# EAGLE schematic mother_bord (EAGLE 6.2)
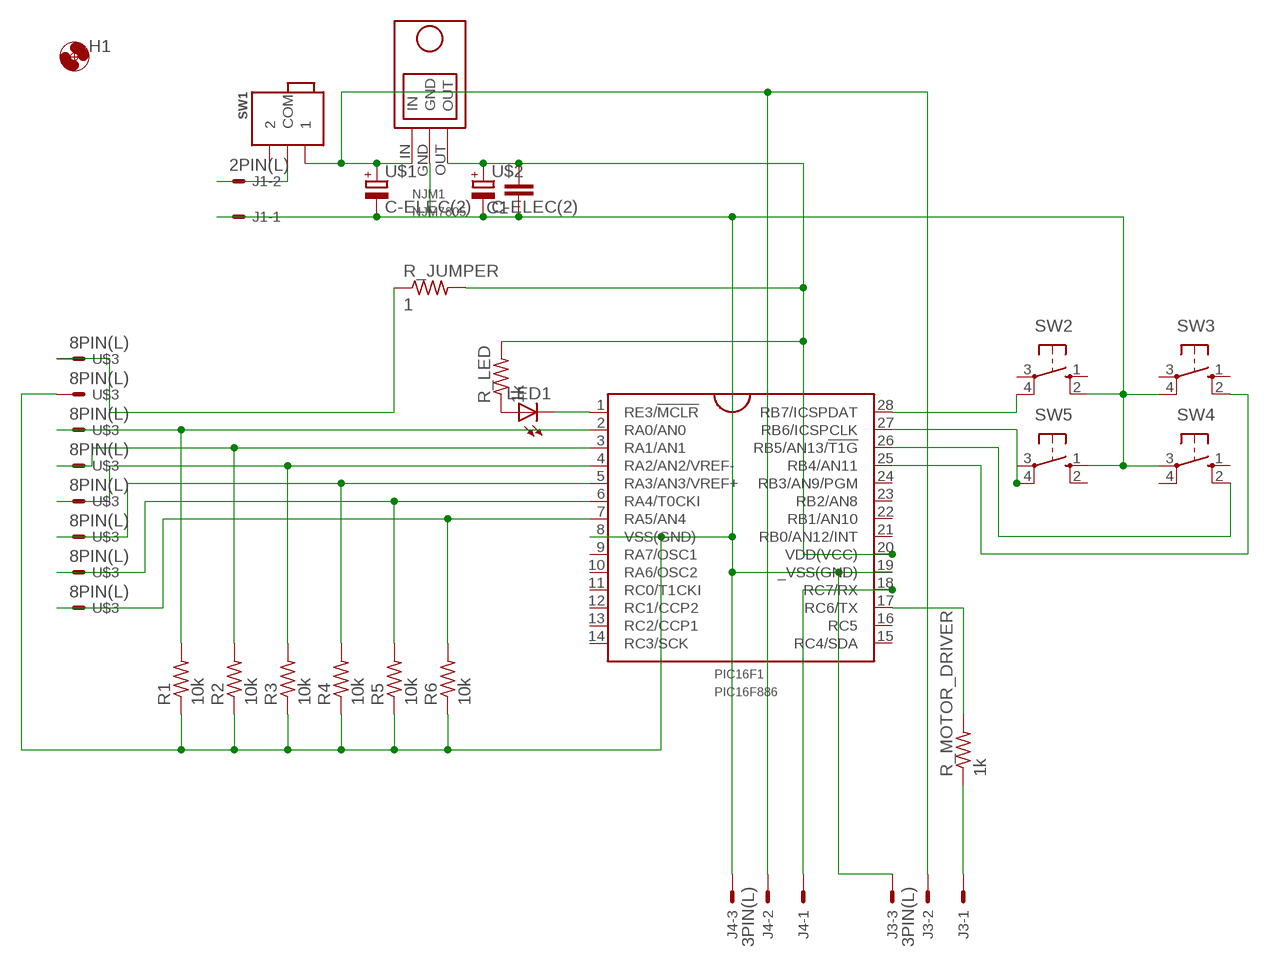
[diagram p0: schematic, sheet 1]

## Parts
C1  C-3  [C-3]
H1  HOLE3.3M3BOLT  [HOLE3.3]
J1  2PIN(L)  [2PL]
J3  3PIN(L)  [3PL]
J4  3PIN(L)  [3PL]
LED1  LED-2  [LED5MM-2]
NJM1  NJM7805  [NJM7805]
PIC16F1  PIC16F886  [DIL28-3]
R1  10k  R-  [0207/10]
R2  10k  R-  [0207/10]
R3  10k  R-  [0207/10]
R4  10k  R-  [0207/10]
R5  10k  R-  [0207/10]
R6  10k  R-  [0207/10]
R_JUMPER  1  R-  [0207/10]
R_LED  1k  R-  [0207/10]
R_MOTOR_DRIVER  1k  R-  [0207/10]
SW1  SWITCH_MININORMAL  [SWITCH_MINI]
SW2  TACTSW  [TACT]
SW3  TACTSW  [TACT]
SW4  TACTSW  [TACT]
SW5  TACTSW  [TACT]
U$1  C-ELEC(2)  [C-6MM(2)]
U$2  C-ELEC(2)  [C-6MM(2)]
U$3  8PIN(L)  [8PL]

## Nets
5V: C1.2 NJM1.OUT PIC16F1.20(VDD(VCC)) R_JUMPER.2 R_LED.2 U$2.+
9V: J1.2 J3.2 J4.2 NJM1.IN SW1.1 SW1.COM U$1.+
GND1: C1.1 J1.1 J3.3 J4.3 NJM1.GND PIC16F1.8(VSS(GND)) PIC16F1.19(_VSS(GND)) R1.1 R2.1 R3.1 R4.1 R5.1 R6.1 SW2.2(S1) SW3.4(P1) SW4.3(P) SW5.1(S) U$1.- U$2.- U$3.P7
N$1: PIC16F1.28(RB7/ICSPDAT) SW2.4(P1)
N$2: PIC16F1.27(RB6/ICSPCLK) SW5.4(P1)
N$3: PIC16F1.26(RB5/AN13/!T1G) SW4.2(S1)
N$4: PIC16F1.25(RB4/AN11) SW3.2(S1)
N$5: LED1.K(C) PIC16F1.1(RE3/!MCLR)
N$6: R_JUMPER.1 U$3.P8
N$7: PIC16F1.2(RA0/AN0) R1.2 U$3.P6
N$8: PIC16F1.17(RC6/TX) R_MOTOR_DRIVER.2
N$9: PIC16F1.3(RA1/AN1) R2.2 U$3.P5
N$10: PIC16F1.4(RA2/AN2/VREF-) R3.2 U$3.P4
N$11: PIC16F1.5(RA3/AN3/VREF+) R4.2 U$3.P3
N$12: PIC16F1.6(RA4/T0CKI) R5.2 U$3.P2
N$13: PIC16F1.7(RA5/AN4) R6.2 U$3.P1
N$14: LED1.A R_LED.1
SIGNAL_MOTOR_DORIVER: J3.1 R_MOTOR_DRIVER.1
SIGNAL_XBEE: J4.1 PIC16F1.18(RC7/RX)
Unconnected: PIC16F1.9(RA7/OSC1) PIC16F1.10(RA6/OSC2) PIC16F1.11(RC0/T1CKI) PIC16F1.12(RC1/CCP2) PIC16F1.13(RC2/CCP1) PIC16F1.14(RC3/SCK) PIC16F1.15(RC4/SDA) PIC16F1.16(RC5) PIC16F1.21(RB0/AN12/INT) PIC16F1.22(RB1/AN10) PIC16F1.23(RB2/AN8) PIC16F1.24(RB3/AN9/PGM) SW1.2 SW2.1(S) SW2.3(P) SW3.1(S) SW3.3(P) SW4.1(S) SW4.4(P1) SW5.2(S1) SW5.3(P)

## Library data of the parts
C1 = My_rcl:C-
H1 = FP-21T for MITS:HOLE3.3
J1 = my_connector:2PIN(L)
J3 J4 = my_connector:3PIN(L)
LED1 = my_led:LED-2
NJM1 = My_NJM7805:NJM7805
PIC16F1 = FixLib:PIC16F886
R1-R6 R_JUMPER R_LED R_MOTOR_DRIVER = My_rcl:R-: Resistor
SW1 = FP-21T for MITS:SWITCH_MINI: Switch 5.08mm
SW2-SW5 = pushsw:TACTSW
U$1 U$2 = My_rcl:C-ELEC(2)
U$3 = my_connector:8PIN(L)